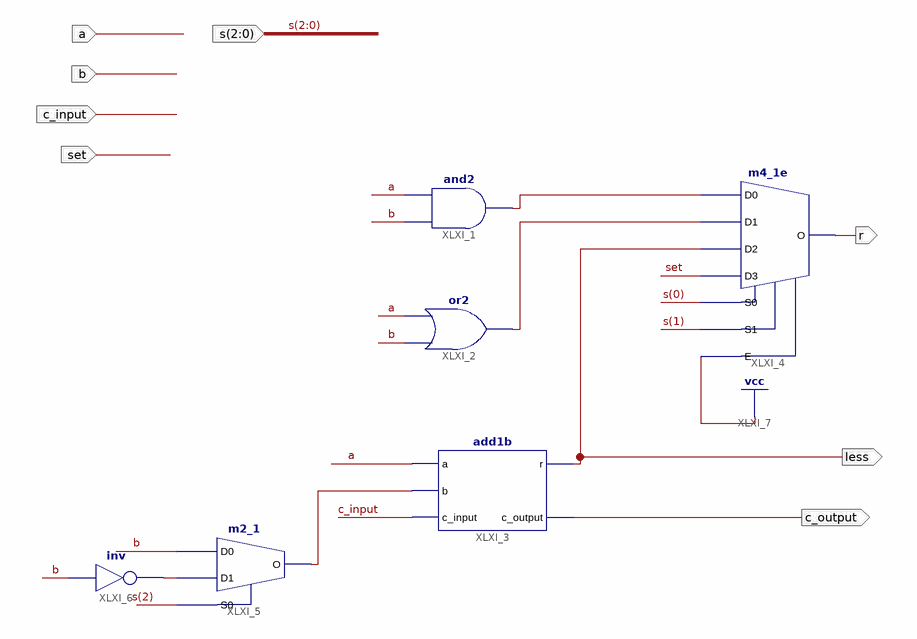
[diagram p0: schematic sheet 1]
// Xilinx ISE schematic alu1b.sch (spartan3e) as structural Verilog: 6 symbols, 8 ports
module alu1b (
  input  a,
  input  b,
  input  c_input,
  input  [2:0] s,
  input  set,
  output c_output,
  output r,
  output less
);

  wire XLXN_8, XLXN_9, XLXN_26, XLXN_27;

  and XLXI_1 (XLXN_8, b, a);
  or XLXI_2 (XLXN_9, b, a);
  add1b XLXI_3 (.a(a), .b(XLXN_27), .c_input(c_input), .r(less), .c_output(c_output));
  m4_1e XLXI_4 (.D0(XLXN_8), .D1(XLXN_9), .D2(less), .D3(set), .E(1'b1), .S0(s[0]), .S1(s[1]), .O(r));
  m2_1 XLXI_5 (.D0(b), .D1(XLXN_26), .S0(s[2]), .O(XLXN_27));
  not XLXI_6 (XLXN_26, b);
endmodule
